# Altium schematic sheet isolationScaleSMD.SchDoc
size 381 x 241 mm; SheetNumber: 1; SheetTotal: 1
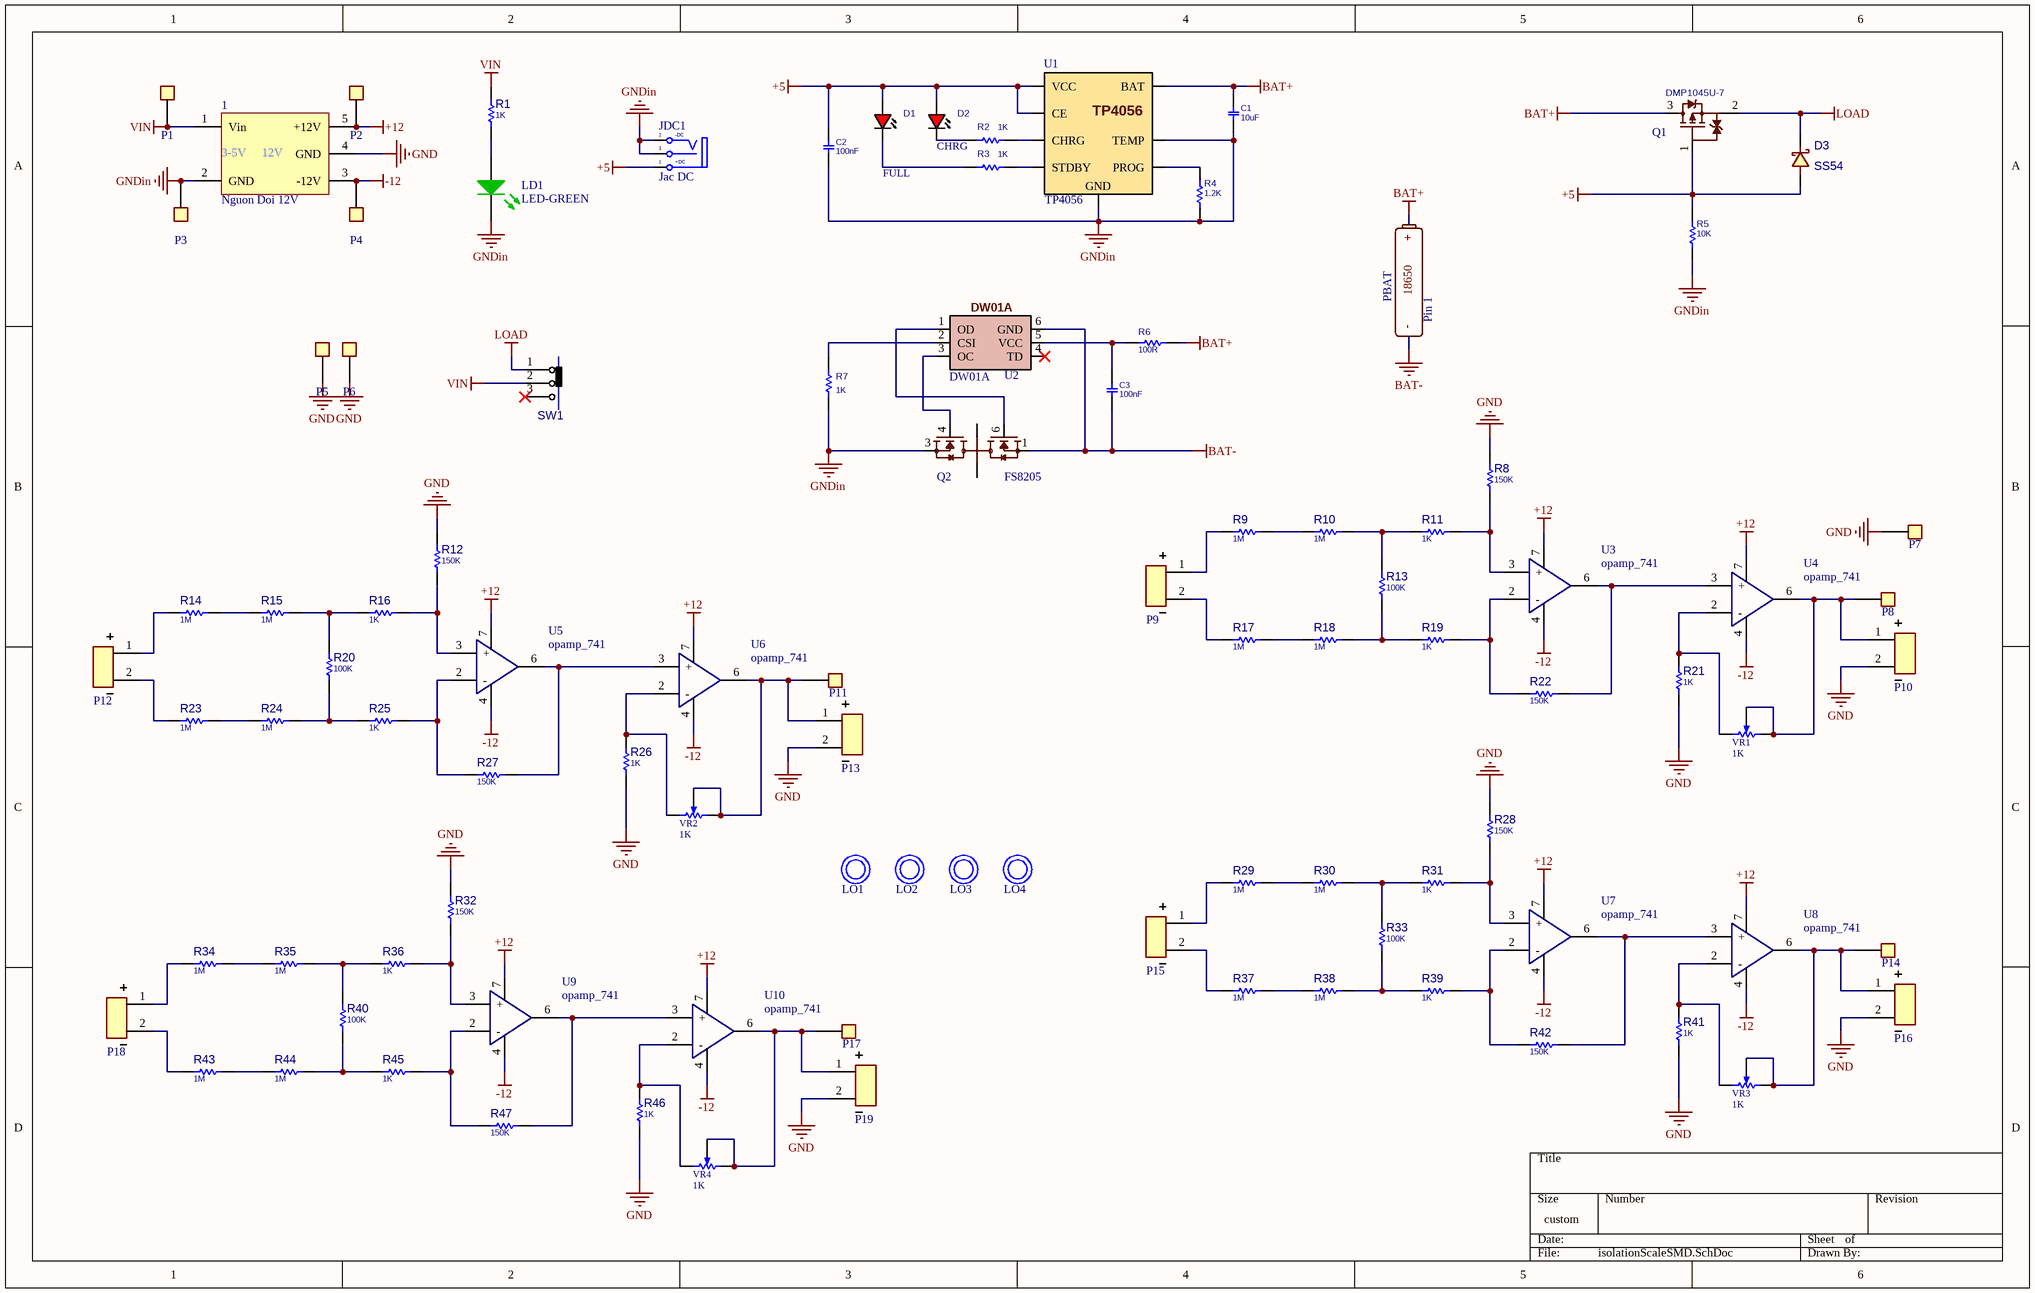
[diagram p0: isolationScaleSMD.SchDoc]

## Parts
1  Nguon Doi 12V  [5V_+-12V]
C1  10uF  [cap_0805]
C2  100nF  [cap_0805]
C3  100nF  [cap_0805]
D1  FULL  [LED0805RED]
D2  CHRG  [LED0805RED]
D3  SS54  [D_SMA]
JDC1  Jac DC  [DC-IN]
LD1  LED-GREEN  [LED RED 0805]
LO1  LO KHOAN  [SCMH_M3P5FT]  (value not drawn)
LO2  LO KHOAN  [SCMH_M3P5FT]  (value not drawn)
LO3  LO KHOAN  [SCMH_M3P5FT]  (value not drawn)
LO4  LO KHOAN  [SCMH_M3P5FT]  (value not drawn)
P1  test PCB  [tp_red_1p]  (value not drawn)
P2  test PCB  [tp_red_1p]  (value not drawn)
P3  test PCB  [Tp_black_1p]  (value not drawn)
P4  test PCB  [tp_red_1p]  (value not drawn)
P5  test PCB  [Tp_black_1p]  (value not drawn)
P6  test PCB  [Tp_black_1p]  (value not drawn)
P7  test PCB  [Tp_black_1p]  (value not drawn)
P8  test PCB  [tp_red_1p]  (value not drawn)
P9  BNC_2p  [BNC_2p]  (value not drawn)
P10  BNC_2p  [BNC_2p]  (value not drawn)
P11  test PCB  [tp_red_1p]  (value not drawn)
P12  BNC_2p  [BNC_2p]  (value not drawn)
P13  BNC_2p  [BNC_2p]  (value not drawn)
P14  test PCB  [tp_red_1p]  (value not drawn)
P15  BNC_2p  [BNC_2p]  (value not drawn)
P16  BNC_2p  [BNC_2p]  (value not drawn)
P17  test PCB  [tp_red_1p]  (value not drawn)
P18  BNC_2p  [BNC_2p]  (value not drawn)
P19  BNC_2p  [BNC_2p]  (value not drawn)
Pin_1  PBAT  [Pin 18650 1 cell]
Q1  DMP1045U-7  [SOT91P240X110-3N]
Q2  FS8205  [SOT23-6]
R1  1K  [R0805]
R2  1K  [R0805]
R3  1K  [R0805]
R4  1.2K  [R0805]
R5  10K  [R0805]
R6  100R  [R0805]
R7  1K  [R0805]
R8  150K  [R0805]
R9  1M  [R0805]
R10  1M  [R0805]
R11  1K  [R0805]
R12  150K  [R0805]
R13  100K  [R0805]
R14  1M  [R0805]
R15  1M  [R0805]
R16  1K  [R0805]
R17  1M  [R0805]
R18  1M  [R0805]
R19  1K  [R0805]
R20  100K  [R0805]
R21  1K  [R0805]
R22  150K  [R0805]
R23  1M  [R0805]
R24  1M  [R0805]
R25  1K  [R0805]
R26  1K  [R0805]
R27  150K  [R0805]
R28  150K  [R0805]
R29  1M  [R0805]
R30  1M  [R0805]
R31  1K  [R0805]
R32  150K  [R0805]
R33  100K  [R0805]
R34  1M  [R0805]
R35  1M  [R0805]
R36  1K  [R0805]
R37  1M  [R0805]
R38  1M  [R0805]
R39  1K  [R0805]
R40  100K  [R0805]
R41  1K  [R0805]
R42  150K  [R0805]
R43  1M  [R0805]
R44  1M  [R0805]
R45  1K  [R0805]
R46  1K  [R0805]
R47  150K  [R0805]
SW1  SlideSwitch  [SWSLIDT_SPDT_S_8X4]  (value not drawn)
U1  TP4056  [SOP-8127P600X175-9N]
U2  DW01A  [SOT23-6]
U3  opamp_741  [DIP-8_2.54_8_t/h]
U4  opamp_741  [DIP-8_2.54_8_t/h]
U5  opamp_741  [DIP-8_2.54_8_t/h]
U6  opamp_741  [DIP-8_2.54_8_t/h]
U7  opamp_741  [DIP-8_2.54_8_t/h]
U8  opamp_741  [DIP-8_2.54_8_t/h]
U9  opamp_741  [DIP-8_2.54_8_t/h]
U10  opamp_741  [DIP-8_2.54_8_t/h]
VR1  1K  [VARIABLE RESISTOR_3362P]
VR2  1K  [VARIABLE RESISTOR_3362P]
VR3  1K  [VARIABLE RESISTOR_3362P]
VR4  1K  [VARIABLE RESISTOR_3362P]

## Nets
+5: C2.2 D1.1(ANODE) D2.1(ANODE) D3.1(A) JDC1.1(T) Q1.1(G) R5.2 U1.4(VCC) U1.8(CE)
+12: 1.5(+12V) P2.1 U3.7(VCC) U4.7(VCC) U5.7(VCC) U6.7(VCC) U7.7(VCC) U8.7(VCC) U9.7(VCC) U10.7(VCC)
-12: 1.3(-12V) P4.1 U3.4(GND) U4.4(GND) U5.4(GND) U6.4(GND) U7.4(GND) U8.4(GND) U9.4(GND) U10.4(GND)
BAT+: C1.2 Pin_1.1(Bat+) Q1.3(D) R6.1 U1.5(BAT)
BAT-: C3.1 Pin_1.2(Bat-) Q2.1(S1) U2.6(GND)
GND: 1.4(GND) P5.1 P6.1 P7.1 P10.2 P13.2 P16.2 P19.2 R8.2 R12.2 R21.1 R26.1 R28.2 R32.2 R41.1 R46.1
GNDin: 1.2(GND) C1.1 C2.1 JDC1.2(TN) JDC1.3(S) LD1.2(K) P3.1 Q2.3(S2) R4.1 R5.1 R7.1 U1.1(TEMP) U1.3(FEEDBACK)
LOAD: D3.2(K) Q1.2(S) SW1.1(P1)
VIN: 1.1(Vin) P1.1 R1.2 SW1.2(P3)
NetC3_2: C3.2 R6.2 U2.5(VCC)
NetD1_2: D1.2(CATHODE) R3.1
NetD2_2: D2.2(CATHODE) R2.1
NetLD1_1: LD1.1(A) R1.1
NetP8_1: P8.1 P10.1 U4.6(OUT) VR1.2 VR1.3
NetP9_1: P9.1 R9.1
NetP9_2: P9.2 R17.1
NetP11_1: P11.1 P13.1 U6.6(OUT) VR2.2 VR2.3
NetP12_1: P12.1 R14.1
NetP12_2: P12.2 R23.1
NetP14_1: P14.1 P16.1 U8.6(OUT) VR3.2 VR3.3
NetP15_1: P15.1 R29.1
NetP15_2: P15.2 R37.1
NetP17_1: P17.1 P19.1 U10.6(OUT) VR4.2 VR4.3
NetP18_1: P18.1 R34.1
NetP18_2: P18.2 R43.1
NetQ2_2: Q2.2(D12) Q2.5(D12)
NetQ2_4: Q2.4(G2) U2.3(OC)
NetQ2_6: Q2.6(G1) U2.1(OD)
NetR2_2: R2.2 U1.7(CHRG)
NetR3_2: R3.2 U1.6(STDBY)
NetR4_2: R4.2 U1.2(PROG)
NetR7_2: R7.2 U2.2(CSI)
NetR8_1: R8.1 R11.2 U3.3(+)
NetR9_2: R9.2 R10.1
NetR10_2: R10.2 R11.1 R13.2
NetR12_1: R12.1 R16.2 U5.3(+)
NetR13_1: R13.1 R18.2 R19.1
NetR14_2: R14.2 R15.1
NetR15_2: R15.2 R16.1 R20.2
NetR17_2: R17.2 R18.1
NetR19_2: R19.2 R22.2 U3.2(-)
NetR20_1: R20.1 R24.2 R25.1
NetR21_2: R21.2 U4.2(-) VR1.1
NetR22_1: R22.1 U3.6(OUT) U4.3(+)
NetR23_2: R23.2 R24.1
NetR25_2: R25.2 R27.2 U5.2(-)
NetR26_2: R26.2 U6.2(-) VR2.1
NetR27_1: R27.1 U5.6(OUT) U6.3(+)
NetR28_1: R28.1 R31.2 U7.3(+)
NetR29_2: R29.2 R30.1
NetR30_2: R30.2 R31.1 R33.2
NetR32_1: R32.1 R36.2 U9.3(+)
NetR33_1: R33.1 R38.2 R39.1
NetR34_2: R34.2 R35.1
NetR35_2: R35.2 R36.1 R40.2
NetR37_2: R37.2 R38.1
NetR39_2: R39.2 R42.2 U7.2(-)
NetR40_1: R40.1 R44.2 R45.1
NetR41_2: R41.2 U8.2(-) VR3.1
NetR42_1: R42.1 U7.6(OUT) U8.3(+)
NetR43_2: R43.2 R44.1
NetR45_2: R45.2 R47.2 U9.2(-)
NetR46_2: R46.2 U10.2(-) VR4.1
NetR47_1: R47.1 U9.6(OUT) U10.3(+)

Not connected (* = marked no-connect by the designer): SW1 3(P4)*; U2 4(TD)*

## Notes on the sheet
- (in symbol DCIN) -DC; +DC
- (in symbol Nguon Doi +-12V) 3-5V; 12V
- (in symbol Pin 18650) +; 18650; -
- (in symbol TP4056) GND

## Library data of the parts
1 = Nguon Doi +-12V
C1-C3 = CAP SMD: PARAM: -, -%; MANF_P#: MANF_PART#; PARAM2: -V; PRICE: 100= 1$; MANF: -; ASSEMBLY: ASSEMBLY
  C1: VALUE: 10uF
  C2 C3: VALUE: 100nF
D1 D2 = LED_SMD_0805_RED: LED, SMD, 0805, RED; DESC: DESCRIPTION; MANF_P#: MANF_PART#; PARAM2: 2.2V; MANF: MANF; ASSEMBLY: ASSEMBLY; PRICE: 36t@Javan
D3 = DIODE_THD_SCHOTTKY_1N5822: DIODE, SCHOTTKY, 40V, 3A; MANF: Diodes; MANF_P#: 1N5822; DESC: DESCRIPTION; ASSEMBLY: ASSEMBLY; PRICE: PRICE; PARAM2: 3A; PARAM: 40V; VALUE: SS54
JDC1 = DCIN: Jac DC input; Value: Jac DC
LD1 = LED_LTST-C191KGKT_1: LED GREEN CLEAR 0603 SMD; Manufacturer 1: Lite-On Inc.; Category 1: Optoelectronics; Lens Color: Colorless; Millicandela Rating: 35mcd; Lens Style/Size: Rectangle with Flat Top, 1.10mm x 0.80mm; Voltage - Forward (Vf) (Typ): 2V; Current - Test: 20mA; Viewing Angle: 130°; Wavelength - Dominant: 571nm; Wavelength - Peak: 574nm; Supplier 1: Digi-Key; Supplier Part Number 1: 160-1446-1-ND; Manufacturer Part Number 1: LTST-C191KGKT; RoHS 1: RoHS Compliant; Description 1: LED GREEN CLEAR 0603 SMD; Stock 1: 1325167; Pricing 1: 1=0.29, 10=0.211, 25=0.1556, 100=0.1111, 250=0.07556, 500=0.06666, 1000=0.05222, 2500=0.05111 (USD); Packaging: Cut Tape (CT); Part Status: Active; Color: Green; Lens Transparency: Clear; Mounting Type: Surface Mount; Features: -; Size / Dimension: 1.60mm L x 0.80mm W; Height (Max): 0.55mm; ComponentLink1URL: http://optoelectronics.liteon.com/upload/download/DS22-2000-228/S_110_LTST-C191KGKT.pdf; ComponentLink1Description: http://optoelectronics.liteon.com/upload/download/DS22-2000-228/S_110_LTST-C191KGKT.pdf; Package / Case: 0603 (1608 Metric)
P1-P8 P11 P14 P17 = test PCB: testpin
Pin_1 = Pin 18650
Q1 = MOSFET DMP1045U-7: MOSFET DMP1045U-7 P Channel; MANF_P#: IRF5305; ASSEMBLY: ASSEMBLY; VALUE: DMP1045U-7
Q2 = FS8205: Dual N-Channel Enhancement Mode Power MOSFET; MF: Fortune Semiconductor; SnapEDA_Link: https://www.snapeda.com/parts/FS8205/Fortune+Semiconductor/view-part/?ref=snap; Package: Package; MP: FS8205; Check_prices: https://www.snapeda.com/parts/FS8205/Fortune+Semiconductor/view-part/?ref=eda; Price: None; Value: *; Availability: Not in stock
R1 R8-R47 = RES_SMD_0805: RESISTOR, SMD, SENS, 0.01Ohm, 0.5W; MANF_P#: WSLP0805R0100FEA; MANF: VISHAY; PARAM: 0.5W, -55~155oC; DESC: DESCRIPTION; DIST#: MOUSER; PARAM2: 1%; ASSEMBLY: ASSEMBLY; PRICE: 0.5$
  R1 R11 R16 R19 R21 R25 R26 R31 R36 R39 R41 R45 R46: VALUE: 1K
  R8 R12 R22 R27 R28 R32 R42 R47: VALUE: 150K
  R9 R10 R14 R15 R17 R18 R23 R24 R29 R30 R34 R35 R37 R38 R43 R44: VALUE: 1M
  R13 R20 R33 R40: VALUE: 100K
R2-R7 = RES SMD: MANF_P#: WSLP0805R0100FEA; MANF: VISHAY; PARAM: 0.5W, -55~155oC; DESC: DESCRIPTION; DIST#: MOUSER; PARAM2: 1%; ASSEMBLY: ASSEMBLY; PRICE: 0.5$
  R2 R3 R7: VALUE: 1K
  R4: VALUE: 1.2K
  R5: VALUE: 10K
  R6: VALUE: 100R
SW1 = SWSLIDT_SPDT_S_8X4: SWITCH, SLIDE, SPDT, 8.6X4.3mm, THD; MANF_PART#: OS102011MS2QN1; MANF: C&K; DESC: DESCRIPTION; VALUE: SlideSwitch; ASSEMBLY: ASSEMBLY; PARAM: PARAM; PRICE: 0.4$
U3-U10 = opamp LM741
VR1-VR4 = Variable Resistor: Square Trimming Potentiometer; AEMS Code: 1400226